# EAGLE schematic PC_v1_double_layers (EAGLE 9.2.0)
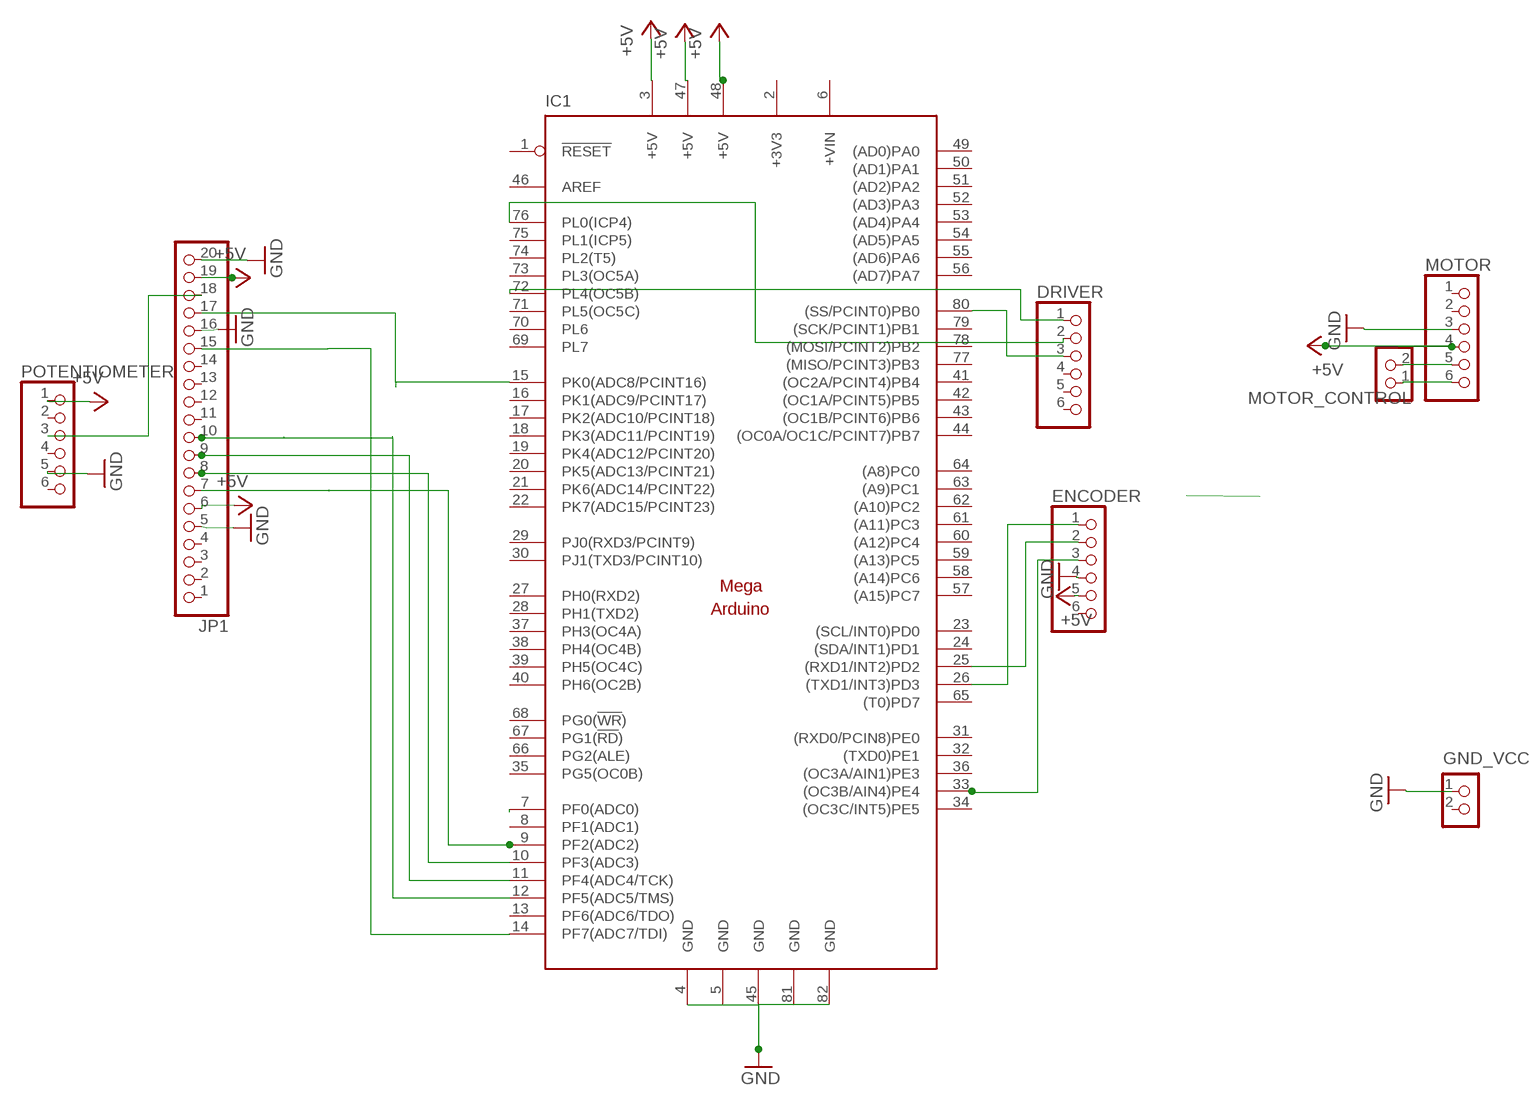
[diagram p0: schematic, sheet 1]

## Parts
DRIVER  PINHD-1X6CLEAN  [1X06-CLEAN]
ENCODER  PINHD-1X6CLEAN  [1X06-CLEAN]
GND_VCC  CON_TERMINAL_BLOCK_02-5MM  [TERMINAL_BLOCK_2P_5]
IC1  MEGAARDUINO_1  [MEGA_ARDUINO]
JP1  PINHD-1X20  [1X20]
MOTOR  PINHD-1X6CLEAN  [1X06-CLEAN]
MOTOR_CONTROL  CON_TERMINAL_BLOCK_02-5MM  [TERMINAL_BLOCK_2P_5]
POTENTIOMETER  PINHD-1X6CLEAN  [1X06-CLEAN]

## Nets
+5V: ENCODER.5 IC1.3(+5V) IC1.47(+5V) IC1.48(+5V) JP1.6 JP1.19 MOTOR.4 POTENTIOMETER.1
GND: ENCODER.4 GND_VCC.1 IC1.4(GND) IC1.5(GND) IC1.45(GND) IC1.81(GND) IC1.82(GND) JP1.5 JP1.16 JP1.20 MOTOR.3 POTENTIOMETER.5
N$1: ENCODER.1 IC1.26((TXD1/INT3)PD3)
N$2: ENCODER.2 IC1.25((RXD1/INT2)PD2)
N$4: MOTOR.5 MOTOR_CONTROL.2
N$5: MOTOR.6 MOTOR_CONTROL.1
N$6: DRIVER.3 IC1.80((SS/PCINT0)PB0)
N$7: DRIVER.2 IC1.76(PL0(ICP4))
N$8: DRIVER.1 IC1.72(PL4(OC5B))
N$10: JP1.18 POTENTIOMETER.3
N$11: IC1.15(PK0(ADC8/PCINT16)) JP1.17
N$13: IC1.11(PF4(ADC4/TCK)) JP1.9
N$15: IC1.7(PF0(ADC0))
N$16: ENCODER.3 IC1.33((OC3B/AIN4)PE4)
N$17: IC1.14(PF7(ADC7/TDI)) JP1.15
N$18: IC1.9(PF2(ADC2)) JP1.7
N$21: IC1.12(PF5(ADC5/TMS)) JP1.10
N$23: IC1.10(PF3(ADC3)) JP1.8
Unconnected: DRIVER.4 DRIVER.5 DRIVER.6 ENCODER.6 GND_VCC.2 IC1.1(!RESET) IC1.8(PF1(ADC1)) IC1.13(PF6(ADC6/TDO)) IC1.16(PK1(ADC9/PCINT17)) IC1.17(PK2(ADC10/PCINT18)) IC1.18(PK3(ADC11/PCINT19)) IC1.19(PK4(ADC12/PCINT20)) IC1.20(PK5(ADC13/PCINT21)) IC1.21(PK6(ADC14/PCINT22)) IC1.22(PK7(ADC15/PCINT23)) IC1.23((SCL/INT0)PD0) IC1.24((SDA/INT1)PD1) IC1.27(PH0(RXD2)) IC1.28(PH1(TXD2)) IC1.29(PJ0(RXD3/PCINT9)) IC1.30(PJ1(TXD3/PCINT10)) IC1.31((RXD0/PCIN8)PE0) IC1.32((TXD0)PE1) IC1.34((OC3C/INT5)PE5) IC1.35(PG5(OC0B)) IC1.36((OC3A/AIN1)PE3) IC1.37(PH3(OC4A)) IC1.38(PH4(OC4B)) IC1.39(PH5(OC4C)) IC1.40(PH6(OC2B)) IC1.41((OC2A/PCINT4)PB4) IC1.42((OC1A/PCINT5)PB5) IC1.43((OC1B/PCINT6)PB6) IC1.44((OC0A/OC1C/PCINT7)PB7) IC1.46(AREF) IC1.49((AD0)PA0) IC1.50((AD1)PA1) IC1.51((AD2)PA2) IC1.52((AD3)PA3) IC1.53((AD4)PA4) IC1.54((AD5)PA5) IC1.55((AD6)PA6) IC1.56((AD7)PA7) IC1.57((A15)PC7) IC1.58((A14)PC6) IC1.59((A13)PC5) IC1.60((A12)PC4) IC1.61((A11)PC3) IC1.62((A10)PC2) IC1.63((A9)PC1) IC1.64((A8)PC0) IC1.65((T0)PD7) IC1.66(PG2(ALE)) IC1.67(PG1(!RD!)) IC1.68(PG0(!WR!)) IC1.69(PL7) IC1.70(PL6) IC1.71(PL5(OC5C)) IC1.73(PL3(OC5A)) IC1.74(PL2(T5)) IC1.75(PL1(ICP5)) IC1.77((MISO/PCINT3)PB3) IC1.78((MOSI/PCINT2)PB2) IC1.79((SCK/PCINT1)PB1) JP1.1 JP1.2 JP1.3 JP1.4 JP1.11 JP1.12 JP1.13 JP1.14 MOTOR.1 MOTOR.2 POTENTIOMETER.2 POTENTIOMETER.4 POTENTIOMETER.6

## Power pins joined to a net without a drawn wire
+3V3: IC1.2(+3V3)
+VIN: IC1.6(+VIN)

## Library data of the parts
DRIVER ENCODER MOTOR POTENTIOMETER = adafruit:PINHD-1X6: PIN HEADER
GND_VCC MOTOR_CONTROL = dp_devices.v6:CON_TERMINAL_BLOCK_02: 2 poles wire to board terminal block
IC1 = arduino:MEGAARDUINO_1: The Arduino Mega is a microcontroller board based on the ATmega1280. - 54 digital input/output pins (of which 14 can be used as PWM outputs) - 16 analog inputs - 4 UARTs (hardware serial ports) - 16 MHz crystal oscillator - USB connection - power jack - ICSP header - reset button It contains everything needed to support the microcontroller; simply connect it to a computer with a USB cable or power it with a AC-to-DC adapter or battery to get started. The Mega is compatible with most shields designed for the Arduino Duemilanove or Diecimila. http://arduino.cc/en/Main/ArduinoBoardMega
JP1 = adafruit:PINHD-1X20: PIN HEADER